# Altium project Temp Sensor Board.PrjPcb
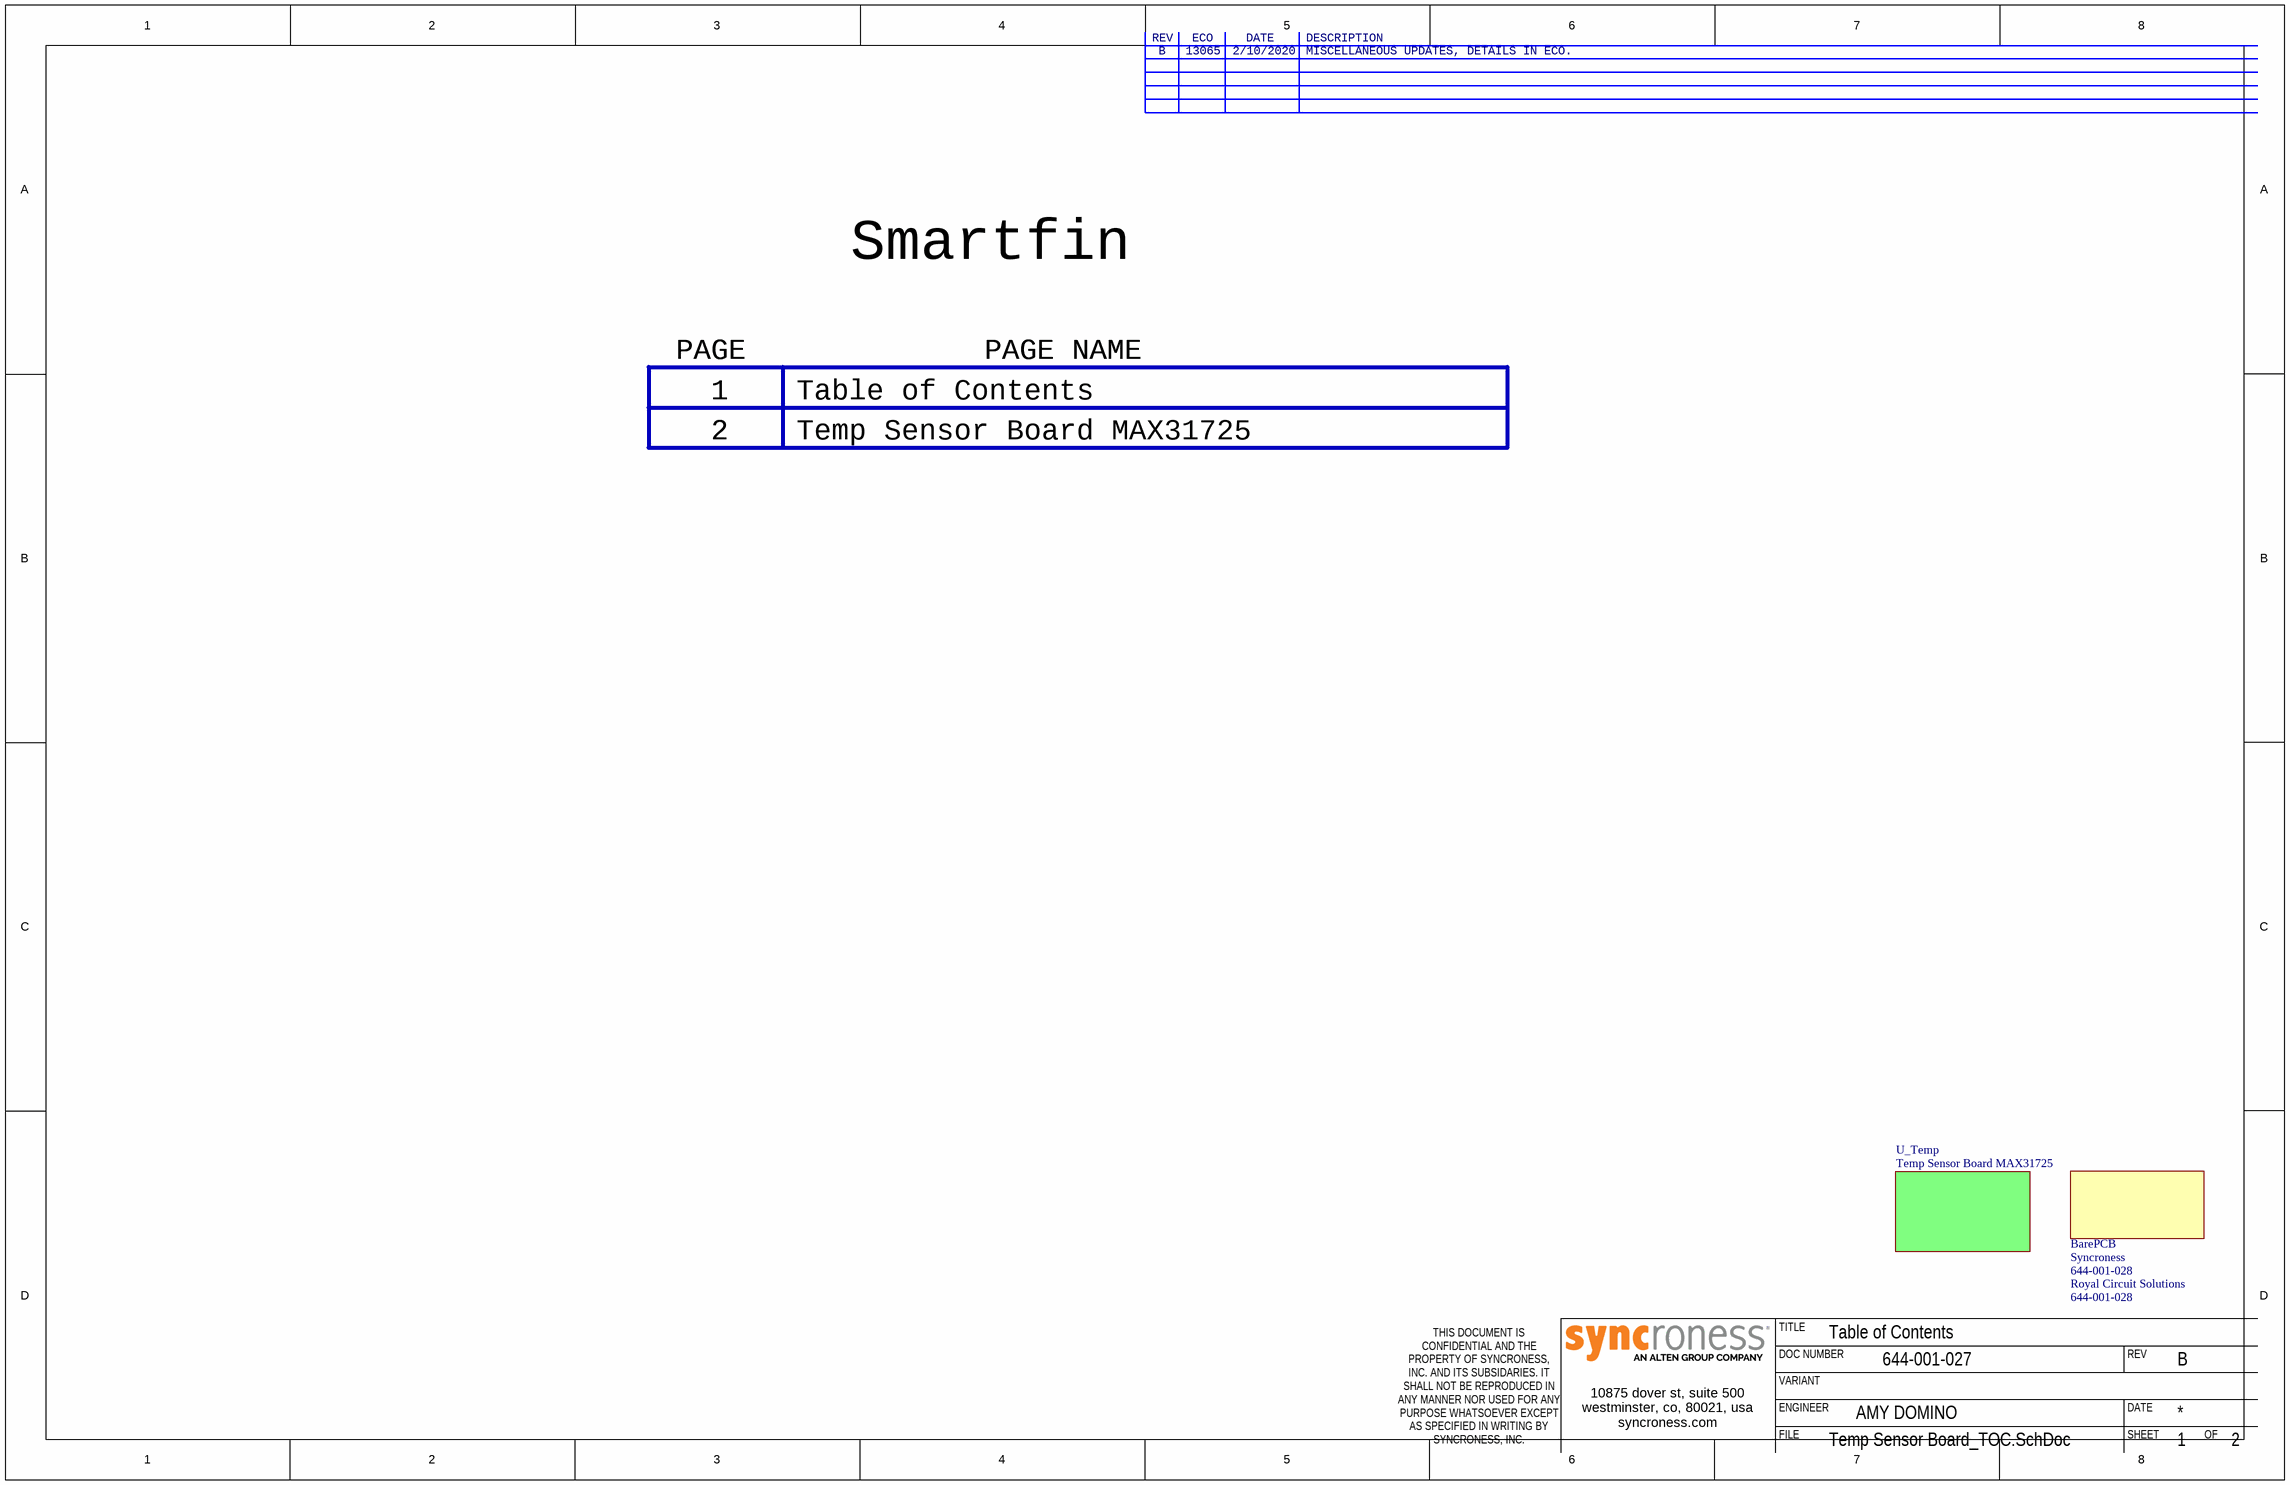
[diagram p0: Temp Sensor Board_TOC.SchDoc]
ASY_Accept_RB_Value: 1; ASY_BOM_FILE_NAME: 644-001-026 BOM REV B ECO13065.XLSX; ASY_CLASS: 2; ASY_Confirmal_Coat_CB_Value: 0; ASY_CURRENT_REV: B; ASY_ECO_DATE1: 2/10/2020; ASY_ECO_DESC1: MISCELLANEOUS UPDATES, DETAILS IN ECO.; ASY_ECO_NUM1: 13065; ASY_ECO_NUM_CURRENT: 13065; ASY_ECO_REV1: B; ASY_Moisture_Sensitive_CB_Value: 0; ASY_NAME: Temp Sensor Board; ASY_ROHS: ROHS COMPLIANT LEAD-FREE SOLDER PROCESS REQUIRED; ASY_RoHS_CB_Value: True; ASY_WASH: NOT PERMITTED; ASY_Wash_CB_Value: 0; ASY_XYRS_FILE_NAME: 644-001-029 ASY REV B XYRS ECO13065.TXT; ASYDWG_DOCNUM: 644-001-029; ASYDWG_MOISTURE_SENSITIVE: THIS DESIGN DOES NOT INCLUDE MOISTURE SENSITIVE PARTS; ASYNOTE_1: 1.  DIMENSIONS ARE IN INCHES.; ASYNOTE_2: 2.  REFER TO "644-001-026 BOM REV B ECO13065.XLSX" IN THIS ARCHIVE; ASYNOTE_4: 4.  REFER TO "644-001-029 ASY REV B XYRS ECO13065.TXT" IN THIS ARCHIVE; ASYNOTE_5: 5.  LEAD-FREE SOLDER PROCESS REQUIRED (ROHS).; ASYNOTE_7: 7.  AQUEOUS WASH IS NOT PERMITTED.; ASYNOTE_8: 8.  THIS DESIGN DOES NOT INCLUDE MOISTURE SENSITIVE PARTS.; ASYNOTE_9: 9.  DO NOT APPLY CONFORMAL COATING.; ASYNOTE_10: 10. FINAL ASSEMBLY SHALL CONFORM TO IPC-A-610 CLASS 2.; ASYNOTE_11: 11. LABEL EACH ASSEMBLY WITH STANDARD IN HOUSE BUILD ID AND BOARD NUMBER.; ASYNOTE_MOISTURESENSITIVE: FALSE; ASYNOTE_ROHS: TRUE; ASYNOTE_WASH: FALSE; BASELINE_CURRENT_REV: B; BASELINE_DOCNUM: 644-001; BASELINE_ECO_DATE1: 2/10/2020; BASELINE_ECO_DESC1: MISCELLANEOUS UPDATES, DETAILS IN ECO.; BASELINE_ECO_NUM1: 13065; BASELINE_ECO_NUM_CURRENT: 13065; BASELINE_ECO_REV1: B; BOM_DOCNUM: 644-001-026; CONTACT_EMAIL: AMYMDOMINO@GMAIL.COM; CONTACT_NAME: AMY DOMINO; CONTACT_PHONE: 7207189461; FAB_ACCEPT_RG_VALUE: 1; FAB_CURRENT_REV: B; FAB_DIMENSIONS: INCHES; FAB_DIMENSIONS_RG_VALUE: 0; FAB_DRILL_TOLERANCE: 0.003"; FAB_ECO_DATE1: 2/10/2020; FAB_ECO_DESC1: MISCELLANEOUS UPDATES, DETAILS IN ECO.; FAB_ECO_NUM1: 13065; FAB_ECO_NUM_CURRENT: 13065; FAB_ECO_REV1: B; FAB_FAB_CLASS: 2; FAB_FINISH_RG_VALUE: 0; FAB_FINISHED_CU_WEIGHT: 1.5; FAB_HOLE_LOCATION: 0.008"; FAB_INSPECT_CLASS: 2; FAB_IPC_STD: IPC-6012; FAB_LAYER_REGISTRATION: 0.005"; FAB_LAYERS: 2; FAB_MATERIAL: FR370-HR; FAB_MATERIAL_RG_VALUE: 3; FAB_MIN_ANNULAR_RING: 0.005"; FAB_OVERLAY_COLOR: WHITE; FAB_ROHS: SHALL BE ROHS COMPLIANT; FAB_SOLDER_SLIVERS: 0.004"; FAB_SOLDERMASK_COLOR: BLUE; FAB_STACKUP: USE FABRICATOR'S STANDARD LAYER STACK; FAB_STACKUP_CB_VALUE: 0; FAB_STANDARD_RG_VALUE: 1; FAB_SURFACE_FINISH: ENIG; FAB_THICKNESS: 0.032; FAB_THIEVING_SPACE: 0.100"; FABDWG_DOCNUM: 644-001-028; FABNOTE_1: 1.  DIMENSIONS ARE IN INCHES.; FABNOTE_2A: 2.  FABRICATE PCB PER IPC-6011 AND IPC-6012A, CLASS 2.; FABNOTE_2B: INSPECT PER IPC-A-600, CLASS 2.; FABNOTE_5: 5.  PCB MATERIAL IS EPOXY FIBERGLASS FR370-HR.; FABNOTE_6: 6.  PCB IS 2 LAYERS, THICKNESS IS 0.032", USE FABRICATOR'S STANDARD LAYER STACK.; FABNOTE_9: 9.  SOLDER MASK BOTH SIDES PER IPC-SM-840, COLOR IS BLUE.; FABNOTE_10: 10. OVERLAY ON BOTH SIDES, COLOR IS WHITE, UL-94V0 MARK REQUIRED.; FABNOTE_11: 11. SURFACE FINISH ON ALL EXPOSED COPPER SHALL BE ENIG.; FABNOTE_12: 12. FINISHED PCB SHALL BE ROHS COMPLIANT.; FABNOTE_CUSTOMSTACK: FALSE; FABNOTE_LAYERS: 2; FABNOTE_THICKNESS: 0.032; OVERLAY_COLOR: WHITE; OVERLAY_USE_LPI: FALSE; PROJECT_NAME: Smartfin; PROJECT_NUM: 644-001; SCH_CURRENT_REV: B; SCH_DOCNUM: 644-001-027; SOLDERMASK_COLOR: BLUE; SOLDERMASK_USE_LPI: FALSE
2 sheets, 4 parts. Net scope: global (net labels, ports and power ports of the same name join across sheets).
Board file: Temp Sensor Board.PcbDoc
Sheets:
  Temp Sensor Board_TOC.SchDoc
    U_Temp = Temp Sensor Board MAX31725.SchDoc

## Sheet Temp Sensor Board_TOC.SchDoc: Table of Contents
size Tabloid; TOCFontName: Consolas; TOCFontSize: 24; TOCFontColor: 0; TOCFontAttributes: 0; TOCMaxLinesInTable: 25; TOCVerticalOffset: 200; TOCHorizontalOffset: 500; TOCHorizontalSeparation: 800; TOCVerticalSeparation: 30; TOCHorizTableSize: 640; Engineer: JOHN Q. ENGINEER; DocumentNumber: 000-000-000; Revision: A; SheetNumber: 1; SheetTotal: 2; PageSetup: Record=PageOptions|CenterHorizontal=True|CenterVertical=True|PrintScale=0.96|XCorrection=1.00|YCorrection=1.00|PrintKind=0|BorderSize=5000000|LeftOffset=0|BottomOffset=0|Orientation=2|PaperLength=1000|PaperWidth=1000|Scale=100|PaperSource=7|PrintQuality=-4|MediaType=1|DitherType=10|PaperKind=11" x 17"|PrintScaleMode=1

### Parts
BarePCB  BarePCB  Manufacturer: Syncroness  Manufacturer Part Number: 644-001-028  Supplier 1: Royal Circuit Solutions  (mechanical)

### Sub-sheets
U_Temp = Temp Sensor Board MAX31725: no entries

### Notes on the sheet
- REV
- ECO
- DATE
- DESCRIPTION
- PAGE
- PAGE NAME
- 1
- Table of Contents
- 2
- Temp Sensor Board MAX31725
- TITLE
- DOC NUMBER
- VARIANT
- 10875 dover st, suite 500
  westminster, co, 80021, usa
  syncroness.com
- FILE
- ENGINEER
- SHEET
- OF
- THIS DOCUMENT IS CONFIDENTIAL AND THE PROPERTY OF SYNCRONESS, INC. AND ITS SUBSIDARIES. IT SHALL NOT BE REPRODUCED IN ANY MANNER NOR USED FOR ANY PURPOSE WHATSOEVER EXCEPT AS SPECIFIED IN WRITING BY SYNCRONESS, INC.

### Library data of the parts
BarePCB = CMP-06229-A.6: Component to Add Bare PCB to BOM; Supplier Part Number 1: 644-001-028

## Sheet Temp Sensor Board MAX31725.SchDoc: Temp Sensor MAX31725
size Tabloid; SheetNumber: 2; SheetTotal: 2; PageSetup: Record=PageOptions|CenterHorizontal=True|CenterVertical=True|PrintScale=0.96|XCorrection=1.00|YCorrection=1.00|PrintKind=0|BorderSize=5000000|LeftOffset=0|BottomOffset=0|Orientation=2|PaperLength=1000|PaperWidth=1000|Scale=100|PaperSource=7|PrintQuality=-4|MediaType=1|DitherType=10|PaperKind=11" x 17"|PrintScaleMode=1; Reminder: PRELIMINARY
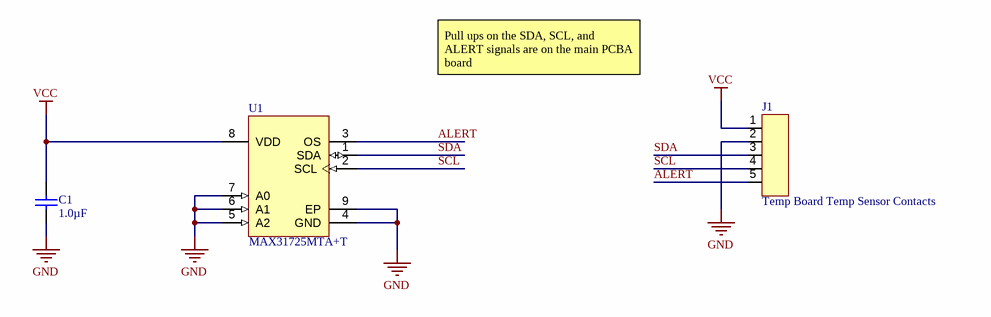
[diagram p1: Temp Sensor Board MAX31725.SchDoc]

### Parts
C1  1.0µF  [CAPC0402(1005)60_N]
J1  Temp Board Temp Sensor Contacts  [Temp Board Temp Sensor Contacts-Footprint-1]  (no BOM)
U1  MAX31725MTA+T  [MAXM-T833+2_V]

### Nets
GND: C1.1 J1.2 U1.4(GND) U1.5(A2) U1.6(A1) U1.7(A0) U1.9(EP)
VCC: C1.2 J1.1 U1.8(VDD)
ALERT: J1.5 U1.3(OS)
SCL: J1.4 U1.2(SCL)
SDA: J1.3 U1.1(SDA)

### Notes on the sheet
- Pull ups on the SDA, SCL, and ALERT signals are on the main PCBA board
- TITLE
- DOC NUMBER
- VARIANT
- REV
- 10875 dover st, suite 500
  westminster, co, 80021, usa
  syncroness.com
- FILE
- ENGINEER
- SHEET
- DATE
- OF
- THIS DOCUMENT IS CONFIDENTIAL AND THE PROPERTY OF SYNCRONESS, INC. AND ITS SUBSIDARIES. IT SHALL NOT BE REPRODUCED IN ANY MANNER NOR USED FOR ANY PURPOSE WHATSOEVER EXCEPT AS SPECIFIED IN WRITING BY SYNCRONESS, INC.

### Library data of the parts
C1 = CMP-13694-A.6: CAP CER 1UF 10V 10% X5R 0402; Manufacturer: Yageo; Manufacturer Part Number: CC0402KRX5R6BB105; Manufacturer 2: Samsung Electro-Mechanics; Manufacturer 3: AVX Corporation; Manufacturer Part Number 2: CL05A105KP5NNNC; Manufacturer Part Number 3: 0402ZD105KAT2A; Operating Temperature: -55°C ~ 85°C; Supplier Part Number 1: 311-1439-1-ND; Supplier Part Number 2: 1276-1076-1-ND; Supplier Part Number 3: 478-4596-1-ND; Temperature Coefficient: X5R; Tolerance: ±10%; Capacitance: 1.0µF; Voltage - Rated: 10V; Supplier 2: Digi-Key; Supplier 3: Digi-Key; Supplier 1: Digi-Key; Datasheet: http://www.samsungsem.com/kr/support/product-search/mlcc/__icsFiles/afieldfile/2019/05/10/19-CL05A105KP5NNNC.pdf
J1 = CMP-23773-A.2: Temp Sensor Contact Pads
U1 = CMP-23703-A.4: SENSOR DIGITAL -55C-150C 8TDFN; Manufacturer: Maxim Integrated; Interface: I2C,SMBus,2-Wire; Max Supply Voltage (DC): 3.7V; Min Supply Voltage (DC): 2.5V; Resolution: 16b; Output Type: Digital,I2C; Number of Pins: 8; Contact Plating: Tin; Min Operating Temperature: -55°C; Max Operating Temperature: 150°C; Package Quantity: 2500; Packaging: Tape and Reel; Operating Supply Voltage: 3.7V; Datasheet: https://datasheets.maximintegrated.com/en/ds/MAX31725.pdf; Manufacturer Part Number: MAX31725MTA+T; Supplier: Digi-Key; Supplier Part Number: MAX31725MTA+TCT-ND

## Assembly variants
Variant of Temp Sensor Board: not fitted J1